# EAGLE design counter (EAGLE 9.0.0)
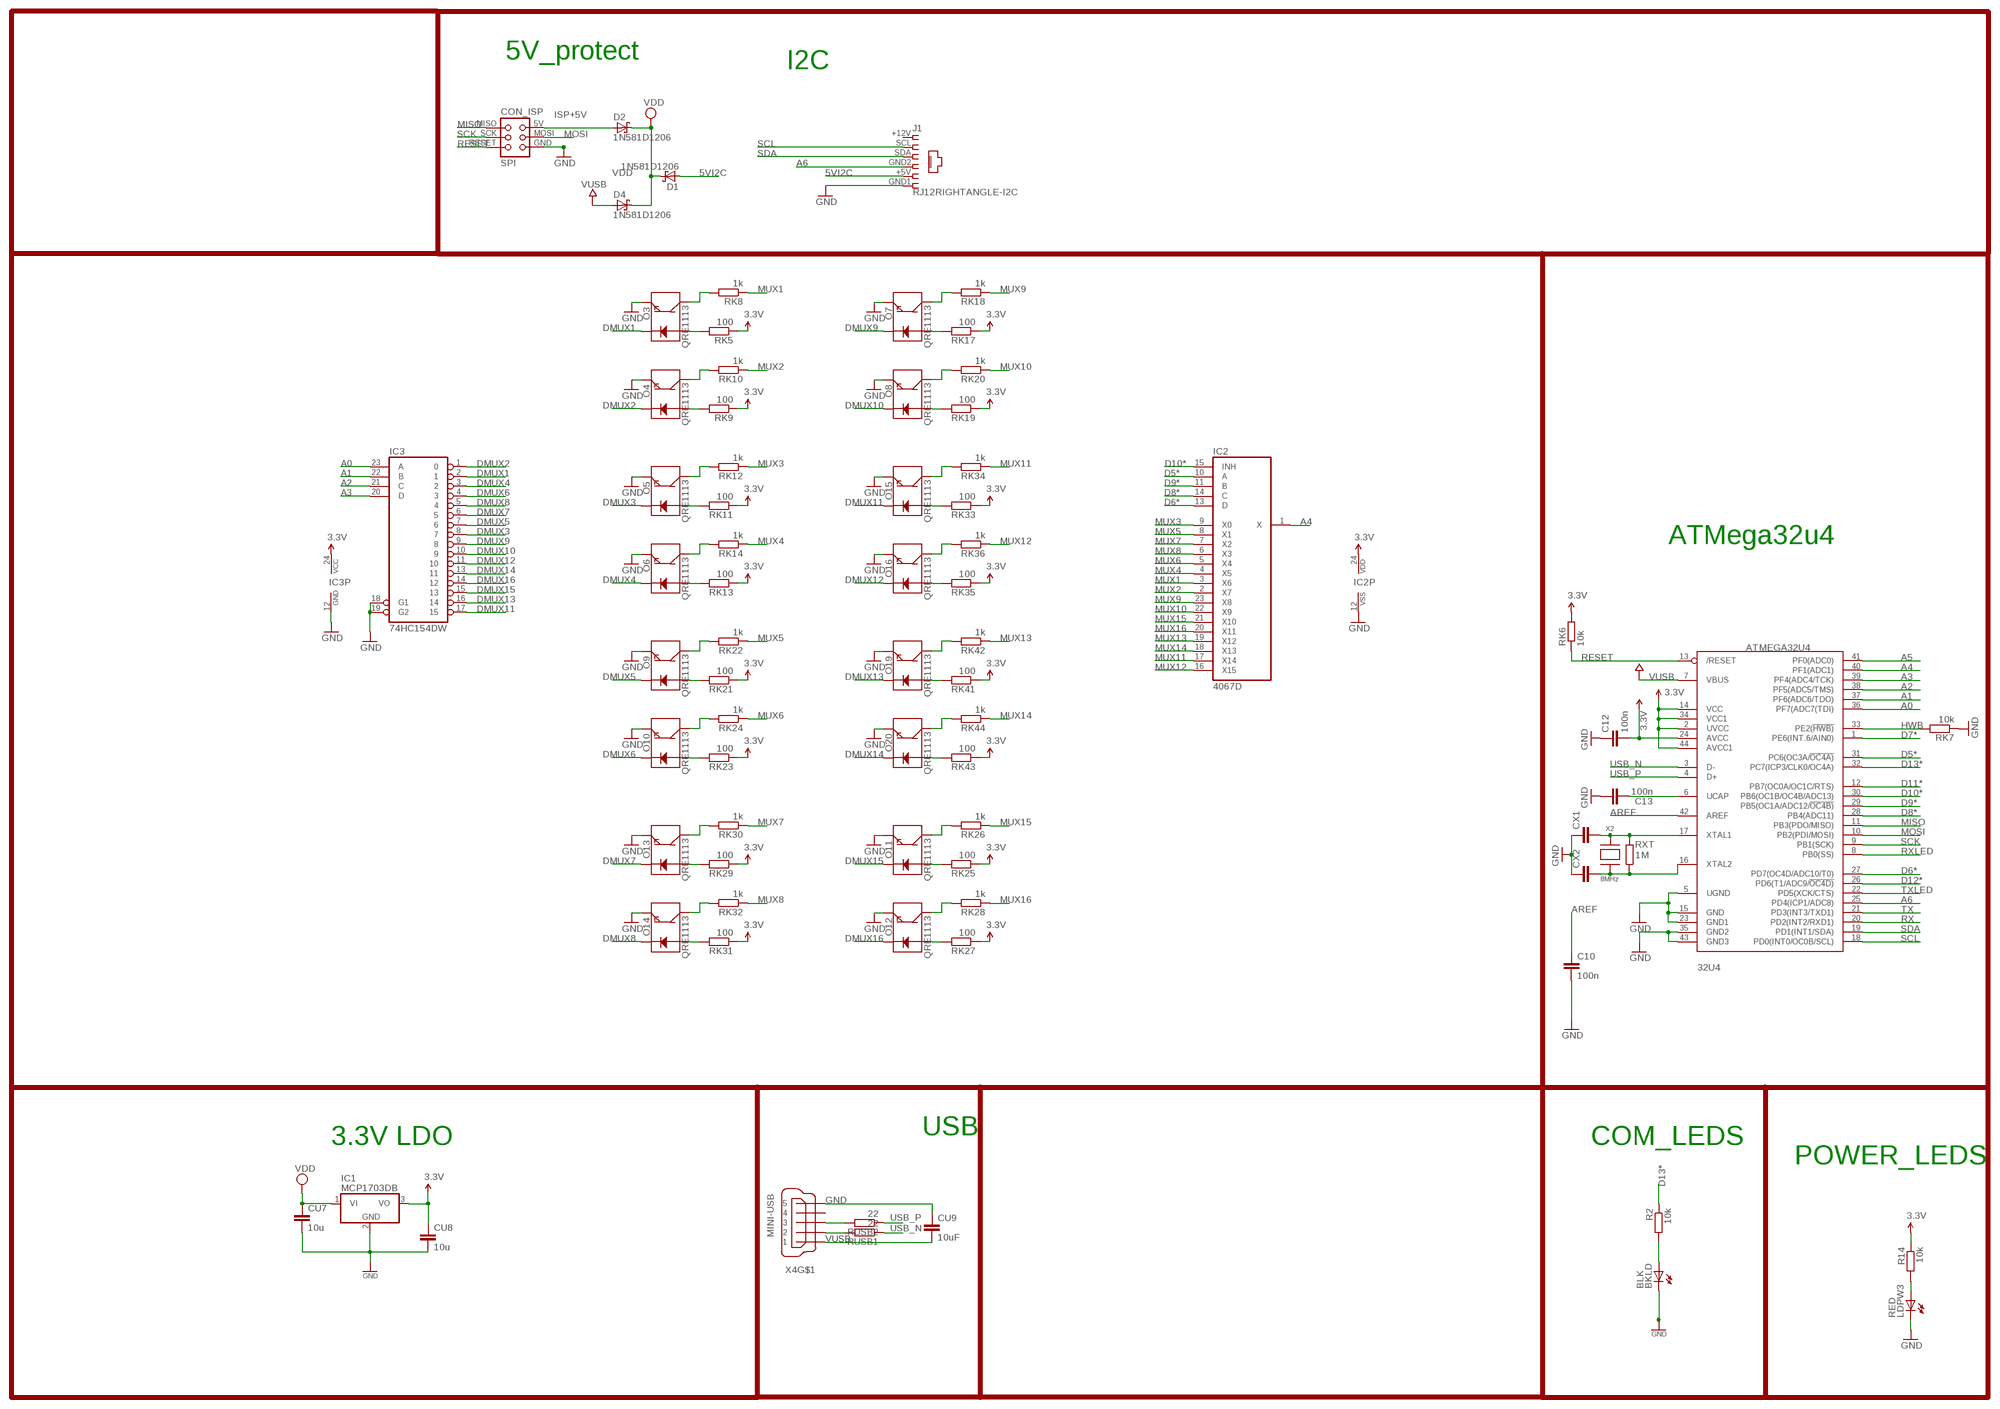
[diagram p0: schematic, sheet 1]

## Parts
32U4  ATMEGA32U4  ATMEGA32U4-AU  [TQFP44]
BKLD  BLK  LEDCHIP-LED0805  [CHIP-LED0805]
C10  100n  C-EUC0805  [C0805]
C12  100n  C-EUC0805  [C0805]
C13  100n  C-EUC0805  [C0805]
CON_ISP  SPI  TINYISPT  [TC2030-MCP-NL]
CU7  10u  C-EUC0805  [C0805]
CU8  10u  C-EUC0805  [C0805]
CU9  10uF  C-EUC0805  [C0805]
CX1  22pF  C-EUC0805  [C0805]
CX2  22pF  C-EUC0805  [C0805]
D1  1N581D1206  [LED-1206]
D2  1N581D1206  [LED-1206]
D4  1N581D1206  [LED-1206]
IC1  MCP1703DB  [SOT223]
IC2  4067D  [SO24W]
IC3  74HC154DW  [SO24W]
J1  RJ12RIGHTANGLE-I2C  [RJ12-RIGHTANGLE-I2C]
LDPW3  RED  LEDCHIP-LED0805  [CHIP-LED0805]
O3  QRE1113  [QRE1113]
O4  QRE1113  [QRE1113]
O5  QRE1113  [QRE1113]
O6  QRE1113  [QRE1113]
O7  QRE1113  [QRE1113]
O8  QRE1113  [QRE1113]
O9  QRE1113  [QRE1113]
O10  QRE1113  [QRE1113]
O11  QRE1113  [QRE1113]
O12  QRE1113  [QRE1113]
O13  QRE1113  [QRE1113]
O14  QRE1113  [QRE1113]
O15  QRE1113  [QRE1113]
O16  QRE1113  [QRE1113]
O19  QRE1113  [QRE1113]
O20  QRE1113  [QRE1113]
R2  10k  R-EU_R0805  [R0805]
R14  10k  R-EU_R0805  [R0805]
RK5  100  R-EU_M0805  [M0805]
RK6  10k  R-EU_M0805  [M0805]
RK7  10k  R-EU_M0805  [M0805]
RK8  1k  R-EU_M0805  [M0805]
RK9  100  R-EU_M0805  [M0805]
RK10  1k  R-EU_M0805  [M0805]
RK11  100  R-EU_M0805  [M0805]
RK12  1k  R-EU_M0805  [M0805]
RK13  100  R-EU_M0805  [M0805]
RK14  1k  R-EU_M0805  [M0805]
RK17  100  R-EU_M0805  [M0805]
RK18  1k  R-EU_M0805  [M0805]
RK19  100  R-EU_M0805  [M0805]
RK20  1k  R-EU_M0805  [M0805]
RK21  100  R-EU_M0805  [M0805]
RK22  1k  R-EU_M0805  [M0805]
RK23  100  R-EU_M0805  [M0805]
RK24  1k  R-EU_M0805  [M0805]
RK25  100  R-EU_M0805  [M0805]
RK26  1k  R-EU_M0805  [M0805]
RK27  100  R-EU_M0805  [M0805]
RK28  1k  R-EU_M0805  [M0805]
RK29  100  R-EU_M0805  [M0805]
RK30  1k  R-EU_M0805  [M0805]
RK31  100  R-EU_M0805  [M0805]
RK32  1k  R-EU_M0805  [M0805]
RK33  100  R-EU_M0805  [M0805]
RK34  1k  R-EU_M0805  [M0805]
RK35  100  R-EU_M0805  [M0805]
RK36  1k  R-EU_M0805  [M0805]
RK41  100  R-EU_M0805  [M0805]
RK42  1k  R-EU_M0805  [M0805]
RK43  100  R-EU_M0805  [M0805]
RK44  1k  R-EU_M0805  [M0805]
RUSB1  22  R-EU_M0805  [M0805]
RUSB2  22  R-EU_M0805  [M0805]
RXT  1M  R-EU_R0805  [R0805]
X2  8MHz  XTALNX6035  [NX6035]
X4  MINI-USB  MINI-USB-SCHIELD-32005-201  [32005-201]

## Nets
3.3V [power]: 32U4.2(UVCC) 32U4.14(VCC) 32U4.24(AVCC) 32U4.34(VCC1) 32U4.44(AVCC1) C12.2 CU8.1 IC1.3(VO) IC2.24(VDD) IC3.24(VCC) R14.1 RK5.1 RK6.2 RK9.1 RK11.1 RK13.1 RK17.1 RK19.1 RK21.1 RK23.1 RK25.1 RK27.1 RK29.1 RK31.1 RK33.1 RK35.1 RK41.1 RK43.1
5VI2C: D1.A J1.+5V
A0: 32U4.36(PF7(ADC7(TDI)) IC3.23(A)
A1: 32U4.37(PF6(ADC6/TDO)) IC3.22(B)
A2: 32U4.38(PF5(ADC5/TMS)) IC3.21(C)
A3: 32U4.39(PF4(ADC4/TCK)) IC3.20(D)
A4: 32U4.40(PF1(ADC1)) IC2.1(X)
A5: 32U4.41(PF0(ADC0))
A6: 32U4.25(PD4(ICP1/ADC8)) J1.GND2
AREF: 32U4.42(AREF) C10.1
D5*: 32U4.31(PC6(OC3A/!OC4A)) IC2.10(A)
D6*: 32U4.27(PD7(OC4D/ADC10/T0)) IC2.13(D)
D7*: 32U4.1(PE6(INT.6/AIN0))
D8*: 32U4.28(PB4(ADC11)) IC2.14(C)
D9*: 32U4.29(PB5(OC1A/ADC12/!OC4B)) IC2.11(B)
D10*: 32U4.30(PB6(OC1B/OC4B/ADC13)) IC2.15(INH)
D11*: 32U4.12(PB7(OC0A/OC1C/RTS))
D12*: 32U4.26(PD6(T1/ADC9/!OC4D))
D13*: 32U4.32(PC7(ICP3/CLK0/OC4A)) R2.1
DMUX1: IC3.2 O3.2(K)
DMUX2: IC3.1 O4.2(K)
DMUX3: IC3.8 O5.2(K)
DMUX4: IC3.3 O6.2(K)
DMUX5: IC3.7 O9.2(K)
DMUX6: IC3.4 O10.2(K)
DMUX7: IC3.6 O13.2(K)
DMUX8: IC3.5 O14.2(K)
DMUX9: IC3.9 O7.2(K)
DMUX10: IC3.10 O8.2(K)
DMUX11: IC3.17 O15.2(K)
DMUX12: IC3.11 O16.2(K)
DMUX13: IC3.16 O19.2(K)
DMUX14: IC3.13 O20.2(K)
DMUX15: IC3.15 O11.2(K)
DMUX16: IC3.14 O12.2(K)
GND [power]: 32U4.5(UGND) 32U4.15(GND) 32U4.23(GND1) 32U4.35(GND2) 32U4.43(GND3) BKLD.C C10.2 C12.1 C13.1 CON_ISP.GND CU7.2 CU8.2 CU9.1 CX1.1 CX2.1 IC1.2(GND) IC2.12(VSS) IC3.12(GND) IC3.18(G1) IC3.19(G2) J1.GND1 LDPW3.C O3.4(E) O4.4(E) O5.4(E) O6.4(E) O7.4(E) O8.4(E) O9.4(E) O10.4(E) O11.4(E) O12.4(E) O13.4(E) O14.4(E) O15.4(E) O16.4(E) O19.4(E) O20.4(E) RK7.1 X4.5
HWB: 32U4.33(PE2(!HWB)) RK7.2
ISP+5V: CON_ISP.5V(VCC) D2.A
MISO: 32U4.11(PB3(PDO/MISO)) CON_ISP.MISO
MOSI: 32U4.10(PB2(PDI/MOSI)) CON_ISP.MOSI
MUX1: IC2.3(X6) RK8.1
MUX2: IC2.2(X7) RK10.1
MUX3: IC2.9(X0) RK12.1
MUX4: IC2.4(X5) RK14.1
MUX5: IC2.8(X1) RK22.1
MUX6: IC2.5(X4) RK24.1
MUX7: IC2.7(X2) RK30.1
MUX8: IC2.6(X3) RK32.1
MUX9: IC2.23(X8) RK18.1
MUX10: IC2.22(X9) RK20.1
MUX11: IC2.17(X14) RK34.1
MUX12: IC2.16(X15) RK36.1
MUX13: IC2.19(X12) RK42.1
MUX14: IC2.18(X13) RK44.1
MUX15: IC2.21(X10) RK26.1
MUX16: IC2.20(X11) RK28.1
N$1: 32U4.6(UCAP) C13.2
N$3: BKLD.A R2.2
N$34: LDPW3.A R14.2
N$42: 32U4.17(XTAL1) CX1.2 RXT.2 X2.P$2
RD3: O3.1(A) RK5.2
RD4: O4.1(A) RK9.2
RD5: O5.1(A) RK11.2
RD6: O6.1(A) RK13.2
RD7: O7.1(A) RK17.2
RD8: O8.1(A) RK19.2
RD9: O9.1(A) RK21.2
RD10: O10.1(A) RK23.2
RD11: O11.1(A) RK25.2
RD12: O12.1(A) RK27.2
RD13: O13.1(A) RK29.2
RD14: O14.1(A) RK31.2
RD15: O15.1(A) RK33.2
RD16: O16.1(A) RK35.2
RD19: O19.1(A) RK41.2
RD20: O20.1(A) RK43.2
RESET: 32U4.13(/RESET) CON_ISP.RESET RK6.1
RX: 32U4.20(PD2(INT2/RXD1))
RXLED: 32U4.8(PB0(SS))
SCK: 32U4.9(PB1(SCK)) CON_ISP.SCK
SCL: 32U4.18(PD0(INT0/OC0B/SCL)) J1.SCL
SDA: 32U4.19(PD1(INT1/SDA)) J1.SDA
TX: 32U4.21(PD3(INT3/TXD1))
TXLED: 32U4.22(PD5(XCK/CTS))
USB_N: 32U4.3(D-) RUSB1.1
USB_P: 32U4.4(D+) RUSB2.1
USBC_N: RUSB1.2 X4.2
USBC_P: RUSB2.2 X4.3
VDD [power]: CU7.1 D1.C D2.C D4.C IC1.1(VI)
VUSB: 32U4.7(VBUS) CU9.2 D4.A X4.1
XTAL1: 32U4.16(XTAL2) CX2.2 RXT.1 X2.P$1
Y3: O3.3(C) RK8.2
Y4: O4.3(C) RK10.2
Y5: O5.3(C) RK12.2
Y6: O6.3(C) RK14.2
Y7: O7.3(C) RK18.2
Y8: O8.3(C) RK20.2
Y9: O9.3(C) RK22.2
Y10: O10.3(C) RK24.2
Y11: O11.3(C) RK26.2
Y12: O12.3(C) RK28.2
Y13: O13.3(C) RK30.2
Y14: O14.3(C) RK32.2
Y15: O15.3(C) RK34.2
Y16: O16.3(C) RK36.2
Y19: O19.3(C) RK42.2
Y20: O20.3(C) RK44.2
Unconnected: X4.4 X4.M1(S:S1) X4.M2(S:S2) X4.M3(S:S3) X4.M4(S:S4)

## Notes on the sheet
- 5V_protect
- I2C
- ATMega32u4
- USB
- 3.3V LDO | COM_LEDS
- POWER_LEDS

## Power pins joined to a net without a drawn wire
1: J1.+12V

## Library data of the parts
32U4 = adafruit:ATMEGA32U4: http://www.ladyada.net/library/eagle
BKLD LDPW3 = adafruit:LED: LED OSRAM: - CHIPLED LG R971, LG N971, LY N971, LG Q971, LY Q971, LO R971, LY R971 LH N974, LH R974 LS Q976, LO Q976, LY Q976 LO Q996 - Hyper CHIPLED LW Q18S LB Q993, LB Q99A, LB R99A - SideLED LS A670, LO A670, LY A670, LG A670, LP A670 LB A673, LV A673, LT A673, LW A673 LH A674 LY A675 LS A676, LA A676, LO A676, LY A676, LW A676 LS A679, LY A679, LG A679 - Hyper Micro SIDELED® LS Y876, LA Y876, LO Y876, LY Y876 LT Y87S - SmartLED LW L88C, LW L88S LB L89C, LB L89S, LG L890 LS L89K, LO L89K, LY L89K LS L896, LA L896, LO L896, LY L896 - TOPLED LS T670, LO T670, LY T670, LG T670, LP T670 LSG T670, LSP T670, LSY T670, LOP T670, LYG T670 LG T671, LOG T671, LSG T671 LB T673, LV T673, LT T673, LW T673 LH T674 LS T676, LA T676, LO T676, LY T676, LB T676, LH T676, LSB T676, LW T676 LB T67C, LV T67C, LT T67C, LS T67K, LO T67K, LY T67K, LW E67C LS E67B, LA E67B, LO E67B, LY E67B, LB E67C, LV E67C, LT E67C LW T67C LS T679, LY T679, LG T679 LS T770, LO T770, LY T770, LG T770, LP T770 LB T773, LV T773, LT T773, LW T773 LH T774 LS E675, LA E675, LY E675, LS T675 LS T776, LA T776, LO T776, LY T776, LB T776 LHGB T686 LT T68C, LB T68C - Hyper Mini TOPLED® LB M676 - Mini TOPLED Santana® LG M470 LS M47K, LO M47K, LY M47K Source: http://www.osram.convergy.de/
C10 C12 C13 CU7-CU9 CX1 CX2 = rcl:C-EU: CAPACITOR, European symbol
CON_ISP = lpatiny:TINYISP: CONNECTOR
D1 D2 D4 = lpatiny:1N581*: 1.0A SCHOTTKY BARRIER RECTIFIER Source: http://www.diodes.com/datasheets/ds23001.pdf
IC1 = linear:MCP1703: 250 mA, 16V, Low Quiescent Current LDO Regulator Source: http://ww1.microchip.com/downloads/en/DeviceDoc/22049b.pdf
IC2 = 40xx:4067: 16-channel ANALOG MULTIPLEXER
IC3 = 74xx-eu:74*154: 4-line to 16-line data SELECTOR/MULTIPLEXER
J1 = lpatiny:RJ12: CORCOM Modular RJ Jacks No Shield Source: www.tycoelectronics.com .. ENG_DS_1654001_1099_RJ_L_0507.pdf
O3-O16 O19 O20 = SparkFun:QRE1113
R2 RXT = rcl:R-EU_: RESISTOR, European symbol
R14 RK5-RK14 RK17-RK36 RK41-RK44 RUSB1 RUSB2 = resistor:R-EU_: RESISTOR, European symbol
X2 = lpatiny:XTAL: Low cost SMT crystals, no capacitors included http://www.ladyada.net/library/eagle
X4 = con-cypressindustries:MINI-USB-SCHIELD-: MINI USB-B Conector Source: www.cypressindustries.com; OC_FARNELL: unknown; OC_NEWARK: unknown

## Net classes
0 default: width 0.203 mm, clearance 0.25 mm
1 power: width 0.203 mm, drill 0.305 mm, clearance 0.25 mm
2 VIN: width 0.254 mm, clearance 0.25 mm
3 fine: width 0.254 mm, clearance 0.25 mm
4 aref: width 0.254 mm, clearance 0.25 mm

## Board
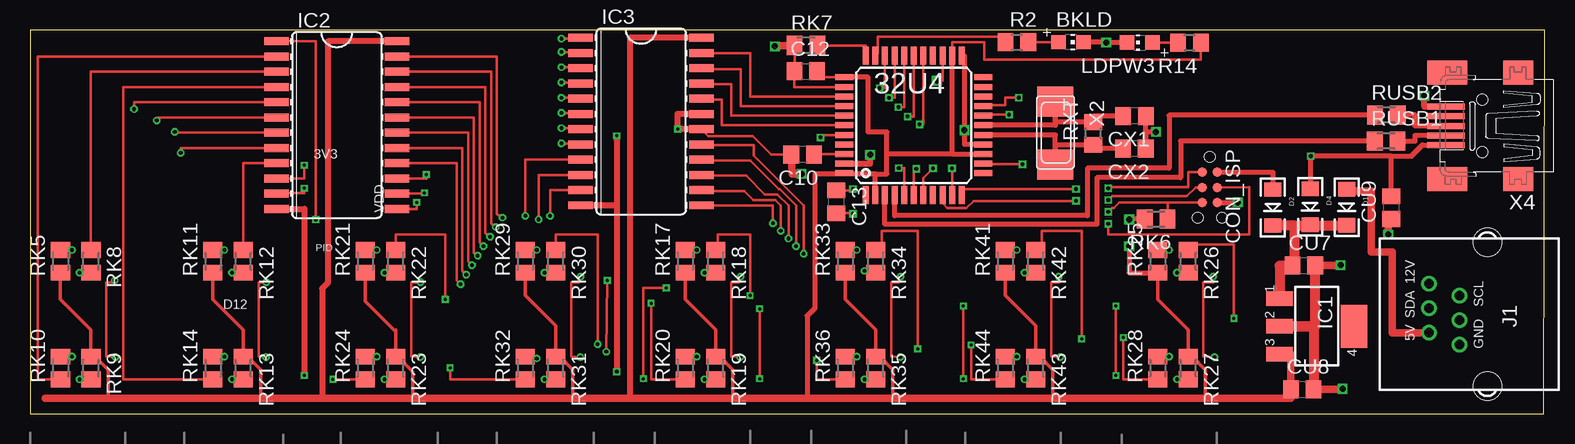
[diagram p1: board, top side]
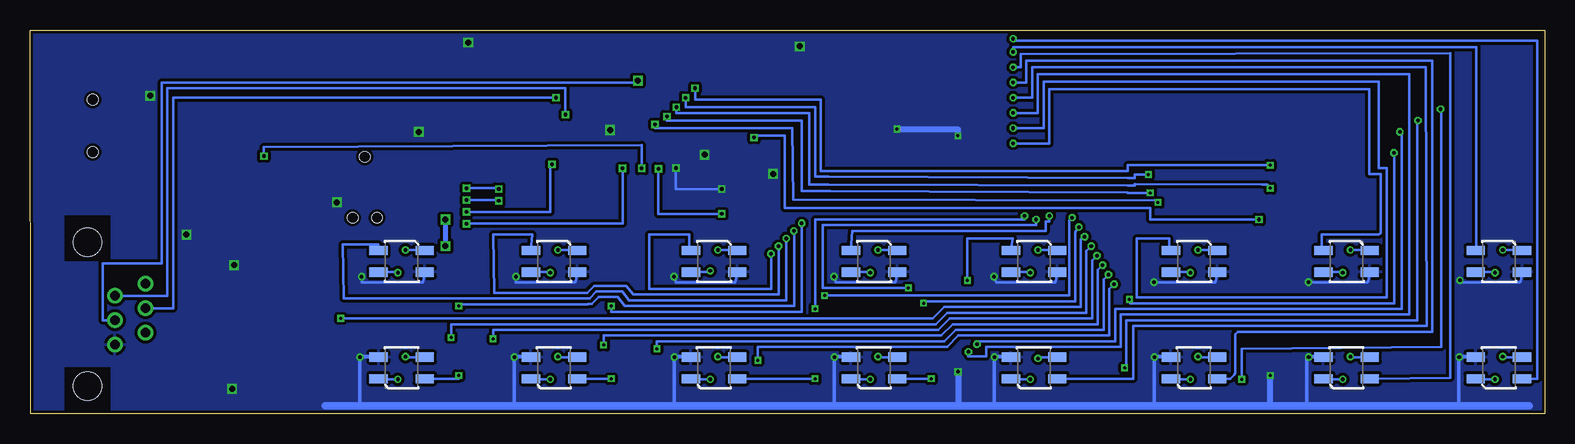
[diagram p2: board, bottom side, seen from below]

Size 126.22 x 32 mm. Coordinates in mm from the lower left corner, seen from the top.
Outline: 0,0 126.16,0 126.22,32 0,32 0,0
Copper layers (1*2*15*16): Top 0.035mm / dielectric 0.2mm / layer 2 0.0175mm / dielectric 1.1mm / layer 15 0.0175mm / dielectric 0.2mm / Bottom 0.035mm
Design rules "SeeedStudio_DRU_no_angle_20130527 *": minimum track width 6mil, minimum drill 8mil, track to track 6mil, track to pad 6mil, pad to pad 6mil, via to via 6mil, smd to smd 0mil, copper to edge 10mil, drill to drill 10mil, minimum pad ring 6mil, minimum via ring 6mil, stop-mask expansion 2mil, vias tented up to drill 25mil, thermal gap 10mil

### Footprints (pad centres in the part's own frame; a part is rotated, then mirrored left to right if it is on the bottom)
TQFP44 = smd 1.5 x 0.5: 1 -5.8,4; 2 -5.8,3.2; 3 -5.8,2.4; 4 -5.8,1.6; 5 -5.8,0.8; 6 -5.8,0; 7 -5.8,-0.8; 8 -5.8,-1.6; 9 -5.8,-2.4; 10 -5.8,-3.2; 11 -5.8,-4; 23 5.8,-4; 24 5.8,-3.2; 25 5.8,-2.4; 26 5.8,-1.6; 27 5.8,-0.8; 28 5.8,0; 29 5.8,0.8; 30 5.8,1.6; 31 5.8,2.4; 32 5.8,3.2; 33 5.8,4 | smd 0.5 x 1.5: 12 -4,-5.8; 13 -3.2,-5.8; 14 -2.4,-5.8; 15 -1.6,-5.8; 16 -0.8,-5.8; 17 0,-5.8; 18 0.8,-5.8; 19 1.6,-5.8; 20 2.4,-5.8; 21 3.2,-5.8; 22 4,-5.8; 34 4,5.8; 35 3.2,5.8; 36 2.4,5.8; 37 1.6,5.8; 38 0.8,5.8; 39 0,5.8; 40 -0.8,5.8; 41 -1.6,5.8; 42 -2.4,5.8; 43 -3.2,5.8; 44 -4,5.8
CHIP-LED0805 = smd 1.2 x 1.2: A 0,-1.05; C 0,1.05
C0805 = smd 1.3 x 1.5: 1 -0.95,0; 2 0.95,0
TC2030-MCP-NL = smd 0.787 x 0.787: 5V 1.27,0.635; GND 3.81,0.635; MISO 1.27,-0.635; MOSI 2.54,0.635; RESET 3.81,-0.635; SCK 2.54,-0.635 | hole 0.889: 0,0; 5.08,-1.016; 5.08,1.016
LED-1206 = smd 1.2 x 1.4: A -1.5,0; C 1.5,0
SOT223 = smd 1.219 x 2.235: 1 -2.311,-3.099; 2 0,-3.099; 3 2.311,-3.099 | smd 3.6 x 2.2: 4 0,3.099
SO24W = smd 0.66 x 2.032: 1 -6.985,-5.029; 2 -5.715,-5.029; 3 -4.445,-5.029; 4 -3.175,-5.029; 5 -1.905,-5.029; 6 -0.635,-5.029; 7 0.635,-5.029; 8 1.905,-5.029; 9 3.175,-5.029; 10 4.445,-5.029; 11 5.715,-5.029; 12 6.985,-5.029; 13 6.985,5.029; 14 5.715,5.029; 15 4.445,5.029; 16 3.175,5.029; 17 1.905,5.029; 18 0.635,5.029; 19 -0.635,5.029; 20 -1.905,5.029; 21 -3.175,5.029; 22 -4.445,5.029; 23 -5.715,5.029; 24 -6.985,5.029
RJ12-RIGHTANGLE-I2C = drill 0.8 pad 1.3: +5V -1.54,4.84; +12V 2.54,4.84; GND1 -2.54,2.3; GND2 -0.5,2.3; SCL 1.54,2.3; SDA 0.5,4.84 | hole 2.36: -6,0; 6,0
QRE1113 = smd 1.524 x 0.762: 1 -1.927,-0.9; 2 1.927,-0.9; 3 1.927,0.9; 4 -1.927,0.9
R0805 = smd 1.3 x 1.5: 1 -0.95,0; 2 0.95,0
M0805 = smd 1.3 x 1.6: 1 -0.95,0; 2 0.95,0
NX6035 = smd 2.5 x 3: P$1 2.665,0; P$2 -2.565,0
32005-201 = smd 3.1 x 0.5: 1 3,1.6; 2 3,0.8; 3 3,0; 4 3,-0.8; 5 3,-1.6 | smd 2.5 x 2: M1 -3,-4.45; M2 -3,4.45 | smd 3.3 x 2: M3 2.9,4.45; M4 2.9,-4.45 | hole 0.9: 0,2.2; 0,-2.2

### Placement (x,y rotation side)
32U4  73.64,24.05 90 top
BKLD  86.74,30.98 270 top
C10  64.39,21.6 180 top
C12  64.64,28.55 0 top
C13  67.17,17.67 270 top
CON_ISP  98.32,21.42 270 top
CU7  106.16,12.36 0 top
CU8  106.02,2.03 0 top
CU9  113.45,17.18 90 top
CX1  92.04,24.82 180 top
CX2  92.03,22.09 180 top
D1  109.72,17.21 270 top
D2  103.57,17.19 270 top
D4  106.68,17.25 270 top
IC1  107.23,7.28 270 top
IC2  25.57,24.07 270 top
IC3  50.92,24.36 270 top
J1  121.44,8.29 90 top
LDPW3  92.48,30.95 90 top
O3  3.81,12.7 180 bottom
O4  3.81,3.81 0 bottom
O5  16.51,12.7 180 bottom
O6  16.51,3.81 0 bottom
O7  55.88,12.7 180 bottom
O8  55.88,3.81 0 bottom
O9  29.21,12.7 180 bottom
O10  29.21,3.81 0 bottom
O11  95.25,12.7 180 bottom
O12  95.25,3.81 0 bottom
O13  42.55,12.7 180 bottom
O14  42.55,3.81 0 bottom
O15  69.22,12.7 180 bottom
O16  69.22,3.81 0 bottom
O19  82.55,12.7 180 bottom
O20  82.55,3.81 0 bottom
R2  82.24,30.99 0 top
R14  96.63,30.93 180 top
RK5  2.54,12.7 90 top
RK6  93.84,16.23 180 top
RK7  64.66,30.71 0 top
RK8  5.08,12.7 270 top
RK9  5.08,3.81 270 top
RK10  2.54,3.81 90 top
RK11  15.24,12.7 90 top
RK12  17.78,12.7 270 top
RK13  17.78,3.81 270 top
RK14  15.24,3.81 90 top
RK17  54.61,12.7 90 top
RK18  57.15,12.7 270 top
RK19  57.15,3.81 270 top
RK20  54.61,3.81 90 top
RK21  27.94,12.7 90 top
RK22  30.48,12.7 270 top
RK23  30.48,3.81 270 top
RK24  27.94,3.81 90 top
RK25  93.98,12.7 90 top
RK26  96.52,12.7 270 top
RK27  96.52,3.81 270 top
RK28  93.98,3.81 90 top
RK29  41.27,12.7 90 top
RK30  43.81,12.7 270 top
RK31  43.81,3.81 270 top
RK32  41.27,3.81 90 top
RK33  67.94,12.7 90 top
RK34  70.48,12.7 270 top
RK35  70.48,3.81 270 top
RK36  67.94,3.81 90 top
RK41  81.28,12.7 90 top
RK42  83.82,12.7 270 top
RK43  83.82,3.81 270 top
RK44  81.28,3.81 90 top
RUSB1  113.02,22.73 0 top
RUSB2  113.03,24.89 0 top
RXT  88.61,23.37 90 top
X2  85.45,23.45 270 top
X4  121,24 180 top

### Tracks (layer width: path | path; a pad name or v marks a point on that pad's centre or on a via)
3.3V  (via drill 0.5)
  Top 0.203: 32U4.34 67.84,28.07 | 32U4.34 65.59,28.05 C12.2 | 70.48,18.25 32U4.2 | 32U4.34 67.84,28.1 | 32U4.24 76.84,30.98 79.53,30.98 79.53,29.53 97.58,29.53 R14.1
  Top 0.305: 30.48,6.99 30.48,6.83 | 30.48,6.83 RK23.1 30.64,4.76 31.91,3.49 31.91,1.53 32.17,1.27 | RK29.1 41.27,9.85 43.81,7.3 RK31.1 44.13,4.76 45.24,3.65 45.24,1.48 45.45,1.27 | RK41.1 81.28,9.85 83.82,7.3 RK43.1 84.14,4.76 85.25,3.65 85.25,1.37 85.35,1.27 | RK25.1 93.98,11.7 93.98,9.53 96.52,6.99 RK27.1 96.84,4.76 97.95,3.65 97.95,1.31 97.9,1.27 | 6.51,1.27 6.51,1.28 6.51,3.65 5.4,4.76 RK9.1 5.08,6.99 2.54,9.53 RK5.1 | 19.26,1.27 19.21,1.32 19.21,3.65 18.1,4.76 RK13.1 17.78,6.99 15.24,9.53 RK11.1 | 58.53,1.27 58.58,1.32 58.58,3.65 57.47,4.76 RK19.1 57.15,6.99 54.61,9.53 RK17.1 | 71.9,1.27 71.91,1.28 71.91,3.65 70.81,4.76 RK35.1 70.48,6.99 67.94,9.53 RK33.1 | 30.48,6.83 27.94,9.37 RK21.1
  Top 0.406: 67.84,20 32U4.44 | 67.84,20 65.41,20 65.41,8.79 64.77,8.16 64.77,1.27 | 32U4.2 70.44,20 | 71.4,21.65 71.4,23.5 69.85,23.5 69.85,28.05 32U4.34 | 76.84,21.65 71.4,21.65 | 76.84,21.65 32U4.14 | 76.84,21.65 32U4.24 | 70.44,20 67.84,20 | 70.44,20 71.4,20 71.4,21.65 | RK6.2 91.64,16.23 v91.6,16.19 | v91.6,13.97 91.6,11.75 93.93,11.75 93.98,11.7
  Top 0.508: IC3.24 49.99,31.35 49.99,1.27 | IC2.24 24.81,31.05 24.81,10.92 24.34,10.44 24.34,1.27
  Top 0.61: 1.27,1.27 6.51,1.27 19.26,1.27 24.34,1.27 32.17,1.27 45.45,1.27 49.99,1.27 58.53,1.27 64.77,1.27 71.9,1.27 85.35,1.27 97.9,1.27 105.07,1.27 CU8.1 105.07,4.97 IC1.3
  Bottom 0.406: v91.6,16.19 v91.6,13.97
5VI2C
  Top 0.61: J1.+5V 113.51,6.75 113.51,13.49 111.76,13.49 111.76,18.57 109.72,18.57 D1.A
A0
  Top 0.203: 32U4.36 60.01,26.45 60.01,30.08 IC3.23
A1
  Top 0.203: IC3.22 55.95,28.73 59.21,28.73 59.21,25.65 32U4.37
A2
  Top 0.203: IC3.21 55.95,27.46 58.42,27.46 58.42,24.85 32U4.38
A3
  Top 0.203: IC3.20 55.95,26.19 57.63,26.19 57.63,24.05 32U4.39
A4  (via drill 0.3)
  Top 0.203: IC2.1 23.81,31.05 v23.81,16.19 | 32U4.40 65.88,23.25 v65.88,23.03
  Bottom 0.203: v23.81,16.19 32.86,16.19 32.86,17.14 63.34,17.14 63.34,23.18 65.88,23.18 v65.88,23.03
A6  (via drill 0.5)
  Top 0.203: v75.56,27.78 76.04,27.78 32U4.25
  Bottom 0.203: J1.GND2 120.17,7.79 120.17,12.54 115.25,12.54 115.25,27.62 75.56,27.62 v75.56,27.78
AREF
  Top 0.203: 32U4.42 65.33,21.65 C10.1
D5*  (via drill 0.25, 0.3)
  Top 0.203: IC2.10 22.86,19.62 v22.86,20.72 | v70.8,27.15 71.24,27.15 32U4.31
  Bottom 0.203: v70.8,27.15 70.8,26.19 60.33,26.19 60.33,20.24 34.75,20.24 34.75,20.72 v22.86,20.72
D6*  (via drill 0.25, 0.3)
  Top 0.203: 30.6,17.14 IC2.13 32.23,17.08 v32.23,17.62 | v74.14,24.13 74.44,24.13 32U4.27
  Bottom 0.203: v32.23,17.62 32.23,17.78 62.63,17.86 62.71,23.81 74.14,23.81 v74.14,24.13
D8*  (via drill 0.25, 0.3)
  Top 0.203: IC2.14 32.86,18.35 v32.86,18.41 | v73.14,24.79 73.64,24.79 32U4.28
  Bottom 0.203: v73.14,24.79 73.14,24.45 61.91,24.45 61.91,18.57 59.85,18.57 59.53,18.57 34.75,18.42 34.14,18.42 33.58,18.41 v32.86,18.41
D9*  (via drill 0.25, 0.3)
  Top 0.203: IC2.11 20.54,18.41 22.86,18.41 v22.86,18.8 | v72.36,25.57 72.84,25.57 32U4.29
  Bottom 0.203: v72.36,25.57 72.36,25.08 61.28,25.08 61.28,19.12 59.69,19.12 34.75,19.01 34.14,19.01 34.14,19.17 23.54,19.12 23.13,19.12 v22.86,18.8
D10*  (via drill 0.25, 0.3)
  Top 0.203: v71.58,26.35 72.04,26.35 32U4.30 | IC2.15 33.02,19.62 v33.02,19.94
  Bottom 0.203: v71.58,26.35 71.58,25.56 60.8,25.56 60.8,19.78 59.69,19.78 34.75,19.63 34.14,19.63 34.14,19.94 v33.02,19.94
D13*
  Top 0.203: 32U4.32 70.64,30.05 70.64,30.75 70.64,31.43 81.29,31.43 R2.1
DMUX1  (via drill 0.3)
  Top 0.203: v44.29,30.16 45.89,30.16 IC3.2
  Bottom 0.203: O3.2 5.71,13.6 5.71,30.56 44.29,30.56 v44.29,30.16
DMUX2  (via drill 0.3)
  Top 0.203: v44.29,31.27 45.89,31.27 IC3.1
  Bottom 0.203: O4.2 0.64,2.91 0.64,31.11 44.29,31.11 v44.29,31.27
DMUX3  (via drill 0.3)
  Top 0.203: v44.29,22.54 45.89,22.54 IC3.8
  Bottom 0.203: 18.73,13.6 O5.2 18.57,13.74 18.57,14.92 13.81,14.92 13.65,15.08 13.65,20 14.61,20 14.61,27.07 41.27,27.07 41.27,22.54 v44.29,22.54
DMUX4  (via drill 0.3)
  Top 0.203: v44.29,28.89 45.89,28.89 IC3.3
  Bottom 0.203: O6.2 7.86,2.99 7.86,30.08 43.64,30 43.64,29.89 43.66,29.87 43.66,28.89 v44.29,28.89
DMUX5  (via drill 0.3)
  Top 0.203: v44.29,23.81 45.89,23.81 IC3.7
  Bottom 0.203: O9.2 31.27,13.6 31.27,14.61 32.18,14.61 32.38,14.61 33.97,14.61 33.97,9.68 13.18,9.68 13.18,20.48 13.81,20.48 13.81,27.7 41.75,27.7 41.75,23.81 v44.29,23.81
DMUX6  (via drill 0.3)
  Top 0.203: v44.29,27.62 45.89,27.62 IC3.4
  Bottom 0.203: O10.2 26.19,2.91 25.87,3.23 25.87,3.28 25.8,3.35 25.8,6.59 25.56,6.83 9.37,6.83 9.37,29.45 43.18,29.45 43.18,27.62 v44.29,27.62
DMUX7  (via drill 0.25, 0.3)
  Top 0.203: v48.1,11.11 v48.02,5.16 | v44.29,25.08 45.89,25.08 IC3.6
  Bottom 0.203: v48.1,11.11 48.1,14.61 44.34,14.61 O13.2 | v44.29,25.08 42.23,25.08 42.23,28.34 11.27,28.34 11.27,8.26 35.32,8.26 35.32,5.56 46.51,5.56 46.51,4.76 48.02,4.76 v48.02,5.16
DMUX8  (via drill 0.3)
  Top 0.203: v44.29,26.35 45.89,26.35 IC3.5
  Bottom 0.203: O14.2 34.29,2.91 34.29,7.3 9.84,7.3 9.92,28.89 42.7,28.89 42.7,26.35 v44.29,26.35
DMUX9  (via drill 0.3)
  Top 0.203: IC3.9 41.27,21.19 v41.27,16.49
  Bottom 0.203: O7.2 57.68,15.24 41.59,15.24 41.59,16.03 41.27,16.03 v41.27,16.49
DMUX10  (via drill 0.25, 0.3)
  Top 0.203: v51.12,2.91 51.12,10.48 v53.02,10.48 | v42.39,16.19 42.39,19.92 IC3.10
  Bottom 0.203: v53.02,10.48 60.17,10.48 60.17,15.72 42.39,15.72 v42.39,16.19 | O8.2 v51.12,2.91
DMUX11  (via drill 0.3)
  Top 0.203: v64.47,13.34 64.47,13.68 64.49,13.7 64.49,17.36 60.33,21.53 60.33,22.38 55.95,22.38 IC3.17
  Bottom 0.203: O15.2 71.28,13.6 71.28,14.92 74.61,14.92 74.61,10.4 64.45,10.4 64.45,13.34 v64.47,13.34
DMUX12  (via drill 0.25, 0.3)
  Top 0.203: v60.8,2.91 v60.8,8.74 | IC3.11 43.34,18.65 v43.34,16.49
  Bottom 0.203: O16.2 v60.8,2.91 | v60.8,8.74 60.8,16.19 43.34,16.19 v43.34,16.49
DMUX13  (via drill 0.3)
  Top 0.203: v63.84,13.97 63.84,14.31 63.85,14.33 63.85,17.36 62.48,18.74 62.38,18.74 60.01,21.11 55.95,21.11 IC3.16
  Bottom 0.203: O19.2 84.35,14.92 87.63,14.92 87.55,10.08 79.77,10.08 79.22,10.64 76.53,10.64 75.97,9.92 63.82,9.92 63.82,13.97 v63.84,13.97
DMUX14  (via drill 0.25, 0.3)
  Top 0.203: v77.79,8.97 v77.79,2.91 77.79,2.86 | v61.91,15.88 61.91,17.38 IC3.13
  Bottom 0.203: v77.79,8.97 77.79,8.49 61.91,8.49 v61.91,15.88 | O20.2 v77.79,2.91
DMUX15  (via drill 0.3)
  Top 0.203: v63.2,14.61 63.2,14.95 63.22,14.97 63.22,17.35 62.29,18.28 61.25,18.28 59.69,19.84 55.95,19.84 IC3.15
  Bottom 0.203: O11.2 97.21,14.13 100.17,14.13 100.09,9.6 79.74,9.6 79.71,9.63 79.58,9.63 79.03,10.18 76.87,10.18 76.31,9.47 76.31,9.45 63.18,9.45 63.18,14.61 v63.2,14.61
DMUX16  (via drill 0.25, 0.3)
  Top 0.203: v90.49,3.17 v90.49,8.97 | v62.57,15.24 62.57,17.36 62.1,17.83 60.27,17.83 59.53,18.57 55.95,18.57 IC3.14
  Bottom 0.203: v90.49,3.17 90.49,2.91 O12.2 | v90.49,8.97 90.49,9.13 79.74,9.13 79.71,9.15 79.42,9.15 78.84,9.73 77.24,9.73 76.64,8.97 62.55,8.97 62.55,15.24 v62.57,15.24
GND  (via drill 0.25, 0.3, 0.5)
  Top 0.203: v7.06,11.11 6.99,10.95 6.35,10.95 6.35,4.76 6.43,4.76 v7.12,4.71 | v19.68,10.95 19.05,10.95 19.05,4.76 19.13,4.76 v19.66,4.71 | v32.54,10.95 31.75,10.95 31.75,4.76 31.83,4.76 v32.52,4.71 | v45.88,11.43 45.72,10.95 45.09,10.95 45.09,4.76 45.17,4.76 v45.85,4.71 | v59.21,11.43 59.05,10.95 58.42,10.95 58.42,4.76 58.5,4.76 v59.19,4.71 | v72.55,11.43 72.39,10.95 71.75,10.95 71.75,4.76 71.84,4.76 v72.52,4.71 | v85.72,11.43 85.72,10.95 85.09,10.95 85.09,4.76 85.17,4.76 v85.86,4.71 | v98.58,11.43 98.58,10.95 97.79,10.95 97.79,4.76 97.87,4.76 v98.72,4.71 | RK7.1 63.71,28.07 63.7,28.44 | 63.7,28.44 C12.1 | 32U4.35 63.7,27.25 63.7,28.44 | IC3.18 56.54,23.14 60.21,23.14 61.75,21.6 C10.2 | C13.1 68.58,18.62 v68.58,18.73 | v72.39,20.48 72.84,20.48 32U4.5
  Top 0.406: 67.84,20.8 32U4.43 | 32U4.5 72.87,18.25 | CX1.1 92.98,24.82 92.98,23.5 | 92.98,23.5 CX2.1 | 32U4.15 77.87,22.45 v77.87,23.65 77.87,29.85 32U4.23 | BKLD.C 89.69,30.98 v89.69,30.96 89.69,30.95 LDPW3.C | CON_ISP.GND 100.63,17.61 v100.65,17.62 | v93.82,23.5 92.98,23.5
  Top 0.508: 48.9,17.38 IC3.12 | 48.9,17.38 v48.9,3.49 | IC2.12 22.86,17.08 v22.86,3.17 | IC3.19 53.98,25 v53.98,23.73 IC3.18 | v48.9,23.18 48.9,17.38 | 32U4.43 70.01,20.85 v70.01,21.59 | X4.5 116.2,25.6 v116.2,26.51
  Top 0.61: RK7.1 62.07,30.71 v62.07,30.64 | C10.2 63.5,20 v64.29,20 | CU8.2 109.38,2.03 v109.38,2.06 | CU7.2 109.22,12.36 v109.22,12.38 | CU9.1 113.19,16.23 v113.19,14.92
  Top 0.813: CU7.2 107.11,7.28 IC1.2 106.97,7.28 CU8.2
  Bottom 0.203: O3.4 2.01,11.01 2.06,10.95 6.99,10.95 v7.06,11.11 | v7.12,4.71 O4.4 | O5.4 14.71,11.01 14.76,10.95 v19.68,10.95 | v19.66,4.71 O6.4 | O9.4 27.41,11.01 27.46,10.95 v32.54,10.95 | v32.52,4.71 O10.4 | O13.4 40.74,11.01 40.8,10.95 45.72,10.95 v45.88,11.43 | v45.85,4.71 O14.4 | O7.4 54.08,11.01 54.13,10.95 59.05,10.95 v59.21,11.43 | v59.19,4.71 O8.4 | O15.4 67.42,11.17 67.47,10.95 72.39,10.95 v72.55,11.43 | v72.52,4.71 O16.4 | O19.4 80.75,11.01 80.8,10.95 85.72,10.95 v85.72,11.43 | v85.86,4.71 O20.4 | O11.4 93.45,11.01 93.5,10.95 98.58,10.95 v98.58,11.43 | v98.72,4.71 O12.4 | v68.58,18.73 72.39,18.73 v72.39,20.48
  Bottom 0.305: 18.73,4.76 19.84,4.76 19.84,0.64 | 6.03,4.76 7.14,4.76 7.14,0.64 | 31.43,4.76 32.54,4.76 32.54,0.64 | 44.77,4.76 45.88,4.76 45.88,0.64 | 57.78,4.76 59.21,4.76 59.21,0.64 | 71.44,4.76 72.55,4.76 72.55,0.64 | 84.45,4.76 85.88,4.76 85.88,0.64 | 97.47,4.76 98.74,4.76 98.74,0.64
  Bottom 0.508: v48.9,3.49 48.86,3.49 48.86,0.64 | v22.86,3.17 22.9,3.17 22.9,0.64 | v53.98,23.73 48.9,23.73 v48.9,23.18
  Bottom 0.61: 1.27,0.64 7.14,0.64 19.84,0.64 22.9,0.64 32.54,0.64 45.88,0.64 48.86,0.64 59.21,0.64 72.55,0.64 85.88,0.64 98.74,0.64 101.6,0.64
  pour Bottom: 0,32.07 0,0 126.21,0 126.21,32.07 0.16,32.07
HWB
  Top 0.203: 32U4.33 69.64,30.71 RK7.2
ISP+5V
  Top 0.406: CON_ISP.5V 103.57,20.15 D2.A
MISO  (via drill 0.3)
  Top 0.203: CON_ISP.MISO 96.52,20.15 96.52,20.16 96.52,18.89 89.85,18.89 v89.85,18.8 | v87.15,18.73 77.64,18.73 32U4.11
  Bottom 0.203: v89.85,18.8 87.15,18.8 v87.15,18.73
MOSI  (via drill 0.3)
  Top 0.203: CON_ISP.MOSI 101.6,18.89 101.6,14.92 89.85,14.92 v89.85,15.84 | v76.83,20.45 32U4.10
  Bottom 0.203: v89.85,15.84 76.83,15.88 v76.83,20.45
MUX1
  Top 0.203: IC2.3 5.08,28.51 RK8.1
MUX2
  Top 0.203: RK10.1 0.64,2.86 0.64,29.78 IC2.2
MUX3
  Top 0.203: RK12.1 17.78,20.89 IC2.9
MUX4
  Top 0.203: IC2.4 7.78,27.24 7.78,2.86 11.69,2.86 RK14.1
MUX5  (via drill 0.25, 0.3)
  Top 0.203: v34.61,9.53 34.61,14.92 30.48,14.92 RK22.1 | v12.56,21.75 12.56,22.16 IC2.8
  Bottom 0.203: v34.61,9.53 34.53,9.21 12.54,9.21 12.54,21.75 v12.56,21.75
MUX6  (via drill 0.25, 0.3)
  Top 0.203: v25.24,2.86 25.67,2.86 RK24.1 | v8.67,25.4 8.67,25.97 IC2.5
  Bottom 0.203: v25.24,2.86 25.24,5.4 8.63,5.56 8.63,25.4 v8.67,25.4
MUX7  (via drill 0.3)
  Top 0.203: v47.31,5.79 47.31,14.92 43.81,14.92 RK30.1 | v12.06,23.5 12.06,23.43 IC2.7
  Bottom 0.203: v47.31,5.79 47.31,6.03 35.8,6.03 35.8,8.73 11.91,8.73 11.91,23.5 v12.06,23.5
MUX8  (via drill 0.25, 0.3)
  Top 0.203: v35,3.81 35,2.86 RK32.1 | v10.56,24.45 10.56,24.7 IC2.6
  Bottom 0.203: v35,3.81 34.85,3.81 34.85,7.78 10.64,7.78 10.64,24.45 v10.56,24.45
MUX9  (via drill 0.25, 0.3)
  Top 0.203: v60.01,9.84 60.01,14.92 57.31,14.92 57.31,13.65 RK18.1 | v39.37,16.35 38.89,16.67 38.89,19 | 38.89,19 38.89,19.21 | 38.89,19 38.89,26.99 38.89,29.78 IC2.23
  Bottom 0.203: v60.01,9.84 39.61,9.84 39.61,16.11 v39.37,16.35
MUX10  (via drill 0.25, 0.3)
  Top 0.203: v51.75,9.21 51.75,2.86 RK20.1 | v38.81,15.56 38.42,15.88 38.42,28.51 IC2.22
  Bottom 0.203: v51.75,9.21 51.75,9.37 39.13,9.37 39.13,15.16 v38.81,15.56
MUX11  (via drill 0.25, 0.3)
  Top 0.203: v73.98,5.4 73.98,15.24 70.96,15.24 70.96,13.65 RK34.1 | v36.35,11.59 36.04,11.91 36.04,19.11 36.04,19.21 36.04,22.16 IC2.17
  Bottom 0.203: v73.98,5.4 73.98,6.03 50.04,6.03 49.09,6.99 36.75,6.99 36.75,11.19 v36.35,11.59
MUX12  (via drill 0.25, 0.3)
  Top 0.203: v65.56,4.45 65.56,2.86 RK36.1 | v35.88,10.79 35.56,11.11 35.56,20.89 IC2.16
  Bottom 0.203: v65.56,4.45 65.56,5.56 49.8,5.56 48.85,6.51 36.27,6.51 36.27,10.4 v35.88,10.79
MUX13  (via drill 0.25, 0.3)
  Top 0.203: 87.63,6.03 v87.63,6.23 87.63,15.24 84.3,15.24 84.3,13.65 RK42.1 | v37.31,13.18 36.99,13.41 36.99,24.7 IC2.19
  Bottom 0.203: v87.63,6.23 87.63,6.99 50.52,6.99 49.56,7.94 37.7,7.94 37.7,12.78 v37.31,13.18
MUX14  (via drill 0.25, 0.3)
  Top 0.203: v78.42,5.71 78.42,2.86 RK44.1 | v36.83,12.38 36.51,12.7 36.51,19.2 | 36.51,19.2 36.51,19.37 | IC2.18 36.51,23.43 36.51,19.2
  Bottom 0.203: v78.42,5.71 78.42,6.51 50.28,6.51 49.33,7.46 37.23,7.46 37.23,11.99 v36.83,12.38
MUX15  (via drill 0.25, 0.3)
  Top 0.203: v100.33,7.94 100.33,14.13 97.16,14.13 97.16,13.65 RK26.1 | v38.34,14.76 37.94,15.08 37.94,18.89 37.94,21.43 37.94,27.24 IC2.21
  Bottom 0.203: v100.33,7.94 50.99,7.94 50.04,8.89 38.66,8.89 38.66,14.53 v38.34,14.76
MUX16  (via drill 0.25, 0.3)
  Top 0.203: v91.12,6.35 91.12,2.86 RK28.1 | v37.78,13.97 37.47,14.29 37.47,25.97 IC2.20
  Bottom 0.203: v91.12,6.35 91.12,7.46 50.76,7.46 49.8,8.41 38.18,8.41 38.18,13.57 v37.78,13.97
N$1  (via drill 0.3)
  Top 0.203: C13.2 68.58,16.72 v68.58,16.67 | v73.85,20.43 73.64,20.43 32U4.6
  Bottom 0.203: v68.58,16.67 73.85,16.67 v73.85,20.43
N$3
  Top 0.203: R2.2 BKLD.A
N$34
  Top 0.203: R14.2 93.53,30.93 LDPW3.A
N$42
  Top 0.406: 32U4.17 85.45,24.05 X2.P$2 85.45,24.32 RXT.2 88.61,24.82 CX1.2
RD3  (via drill 0.3)
  Top 0.203: RK5.2 v3.49,13.65
  Bottom 0.203: v3.49,13.65 2.01,13.65 O3.1
RD4  (via drill 0.3)
  Top 0.203: RK9.2 v4.13,2.86
  Bottom 0.203: v4.13,2.86 5.61,2.86 O4.1
RD5  (via drill 0.3)
  Top 0.203: RK11.2 v16.19,13.65
  Bottom 0.203: v16.19,13.65 14.71,13.65 O5.1
RD6  (via drill 0.3)
  Top 0.203: RK13.2 v16.83,2.86
  Bottom 0.203: v16.83,2.86 18.31,2.86 O6.1
RD7  (via drill 0.3)
  Top 0.203: RK17.2 v55.56,13.65
  Bottom 0.203: v55.56,13.65 54.08,13.65 O7.1
RD8  (via drill 0.3)
  Top 0.203: RK19.2 v56.2,2.86
  Bottom 0.203: v56.2,2.86 57.68,2.86 O8.1
RD9  (via drill 0.3)
  Top 0.203: RK21.2 v28.89,13.65
  Bottom 0.203: v28.89,13.65 27.41,13.65 O9.1
RD10  (via drill 0.3)
  Top 0.203: RK23.2 v29.53,2.86
  Bottom 0.203: v29.53,2.86 31.01,2.86 O10.1
RD11  (via drill 0.3)
  Top 0.203: RK25.2 v94.93,13.65
  Bottom 0.203: v94.93,13.65 93.45,13.65 O11.1
RD12  (via drill 0.3)
  Top 0.203: RK27.2 v95.57,2.86
  Bottom 0.203: v95.57,2.86 97.05,2.86 O12.1
RD13  (via drill 0.3)
  Top 0.203: RK29.2 v42.23,13.65
  Bottom 0.203: v42.23,13.65 40.74,13.65 O13.1
RD14  (via drill 0.3)
  Top 0.203: RK31.2 v42.86,2.86
  Bottom 0.203: v42.86,2.86 44.34,2.86 O14.1
RD15  (via drill 0.3)
  Top 0.203: RK33.2 v68.9,13.65
  Bottom 0.203: v68.9,13.65 67.42,13.65 O15.1
RD16  (via drill 0.3)
  Top 0.203: RK35.2 v69.53,2.86
  Bottom 0.203: v69.53,2.86 71.02,2.86 O16.1
RD19  (via drill 0.3)
  Top 0.203: RK41.2 v82.23,13.65
  Bottom 0.203: v82.23,13.65 80.75,13.65 O19.1
RD20  (via drill 0.3)
  Top 0.203: RK43.2 v82.87,2.86
  Bottom 0.203: v82.87,2.86 84.35,2.86 O20.1
RESET  (via drill 0.3)
  Top 0.203: 94.86,17.61 CON_ISP.RESET | 94.86,17.61 90.75,17.61 90.3,17.16 90.18,17.16 v89.85,16.83 | v82.71,20.8 79.44,20.8 32U4.13 | RK6.1 94.79,17.54 94.86,17.61
  Bottom 0.203: v89.85,16.83 82.87,16.83 82.87,20.8 v82.71,20.8
SCK  (via drill 0.3)
  Top 0.203: CON_ISP.SCK 97.15,18.88 96.41,18.14 90.18,18.14 v89.85,17.82 | v87.15,17.75 78.64,17.75 78.04,17.15 76.45,17.15 76.04,17.55 32U4.9
  Bottom 0.203: v89.85,17.82 87.15,17.82 v87.15,17.75
SCL  (via drill 0.3)
  Top 0.203: v81.6,24.94 79.44,24.94 32U4.18
  Bottom 0.203: J1.SCL 117.02,9.83 114.79,9.83 | 114.79,9.83 114.78,9.84 | 114.79,9.83 114.78,9.83 114.78,27.15 81.6,27.15 v81.6,24.94
SDA  (via drill 0.3)
  Top 0.203: 79.44,25.72 32U4.19 79.44,25.72 | v82.39,26.35 81.28,26.35 81.28,25.72 79.44,25.72
  Bottom 0.203: J1.SDA 114.3,8.79 114.3,26.35 v82.39,26.35
USB_N
  Top 0.406: RUSB1.1 95.89,22.73 95.89,19.68 88.9,19.68 88.9,15.8 87.94,15.8 87.86,15.79 71.24,15.79 32U4.3
USB_P
  Top 0.406: RUSB2.1 94.93,24.89 94.93,20.48 88.11,20.48 88.11,16.51 72.04,16.51 32U4.4
USBC_N
  Top 0.406: X4.2 115.41,23.2 115.41,22.7 113.97,22.7 RUSB1.2
USBC_P
  Top 0.406: X4.3 115.41,24 115.41,24.92 113.98,24.92 RUSB2.2
VDD
  Top 0.813: IC1.1 104.13,12.36 CU7.1 105.39,12.36 105.39,15.69 | 106.83,15.71 D1.C | 106.83,15.71 106.67,15.71 D4.C | 105.39,15.69 D2.C | 105.39,15.69 106.83,15.69 106.83,15.71
VUSB  (via drill 0.3)
  Top 0.203: 74.45,18.25 32U4.7 74.44,19.65 v75.25,20.45
  Top 0.406: X4.1 116.04,22.4 115.12,21.48 113.44,21.48 | 113.44,21.48 v106.73,21.48 106.68,21.43 106.67,21.43 D4.A | CU9.2 113.44,21.48
  Bottom 0.203: v75.25,20.45 75.25,22.38 106.73,22.23 v106.73,21.48
XTAL1
  Top 0.406: 32U4.16 85.45,23.25 X2.P$1 85.45,22.41 RXT.1 88.61,22.09 CX2.2
Y3  (via drill 0.3)
  Top 0.203: v4.13,11.75 RK8.2
  Bottom 0.203: O3.3 4.13,11.8 v4.13,11.75
Y4  (via drill 0.3)
  Top 0.203: v3.49,4.76 RK10.2
  Bottom 0.203: O4.3 3.49,4.71 v3.49,4.76
Y5  (via drill 0.3)
  Top 0.203: v16.83,11.75 RK12.2
  Bottom 0.203: O5.3 16.83,11.8 v16.83,11.75
Y6  (via drill 0.3)
  Top 0.203: v16.19,4.76 RK14.2
  Bottom 0.203: O6.3 16.19,4.71 v16.19,4.76
Y7  (via drill 0.3)
  Top 0.203: v56.2,11.75 RK18.2
  Bottom 0.203: O7.3 56.2,11.8 v56.2,11.75
Y8  (via drill 0.3)
  Top 0.203: v55.56,4.76 RK20.2
  Bottom 0.203: O8.3 55.56,4.71 v55.56,4.76
Y9  (via drill 0.3)
  Top 0.203: v29.53,11.75 RK22.2
  Bottom 0.203: O9.3 29.53,11.8 v29.53,11.75
Y10  (via drill 0.3)
  Top 0.203: v28.89,4.76 RK24.2
  Bottom 0.203: O10.3 28.89,4.71 v28.89,4.76
Y11  (via drill 0.3)
  Top 0.203: v95.57,11.75 RK26.2
  Bottom 0.203: O11.3 95.57,11.8 v95.57,11.75
Y12  (via drill 0.3)
  Top 0.203: v94.93,4.76 RK28.2
  Bottom 0.203: O12.3 94.93,4.71 v94.93,4.76
Y13  (via drill 0.3)
  Top 0.203: v42.86,11.75 RK30.2
  Bottom 0.203: O13.3 42.86,11.8 v42.86,11.75
Y14  (via drill 0.3)
  Top 0.203: v42.23,4.6 RK32.2
  Bottom 0.203: O14.3 42.23,4.71 v42.23,4.6
Y15  (via drill 0.3)
  Top 0.203: v69.53,11.91 RK34.2
  Bottom 0.203: O15.3 69.53,11.8 v69.53,11.91
Y16  (via drill 0.3)
  Top 0.203: v68.9,4.76 RK36.2
  Bottom 0.203: O16.3 68.9,4.71 v68.9,4.76
Y19  (via drill 0.3)
  Top 0.203: v82.87,11.75 RK42.2
  Bottom 0.203: O19.3 82.87,11.8 v82.87,11.75
Y20  (via drill 0.3)
  Top 0.203: v82.23,4.76 RK44.2
  Bottom 0.203: O20.3 82.23,4.71 v82.23,4.76

### Text on the board
tNames: 3V3 | VDD | PID | D12
tValues: 1 | 3 | 5 | 7 | 9 | 11 | 13 | 15 | 2 | 4 | 6 | 8 | 10 | 12 | 14 | 16
bValues: 1 | 3 | 5 | 7 | 9 | 11 | 13 | 15 | 2 | 4 | 6 | 8 | 10 | 12 | 14 | 16